# EasyEDA Pro project ProPrj_MOSSE_2026-03-25.epro, schematic Schematic2
Board Name: Board2; Create Date: 2026-03-15; Page Name: P1; Project Name: MOSSE; Schematic Name: Schematic2; Update Date: 2026-03-15; Company: EasyEDA.com; Page Size: A4; Version: V1.0
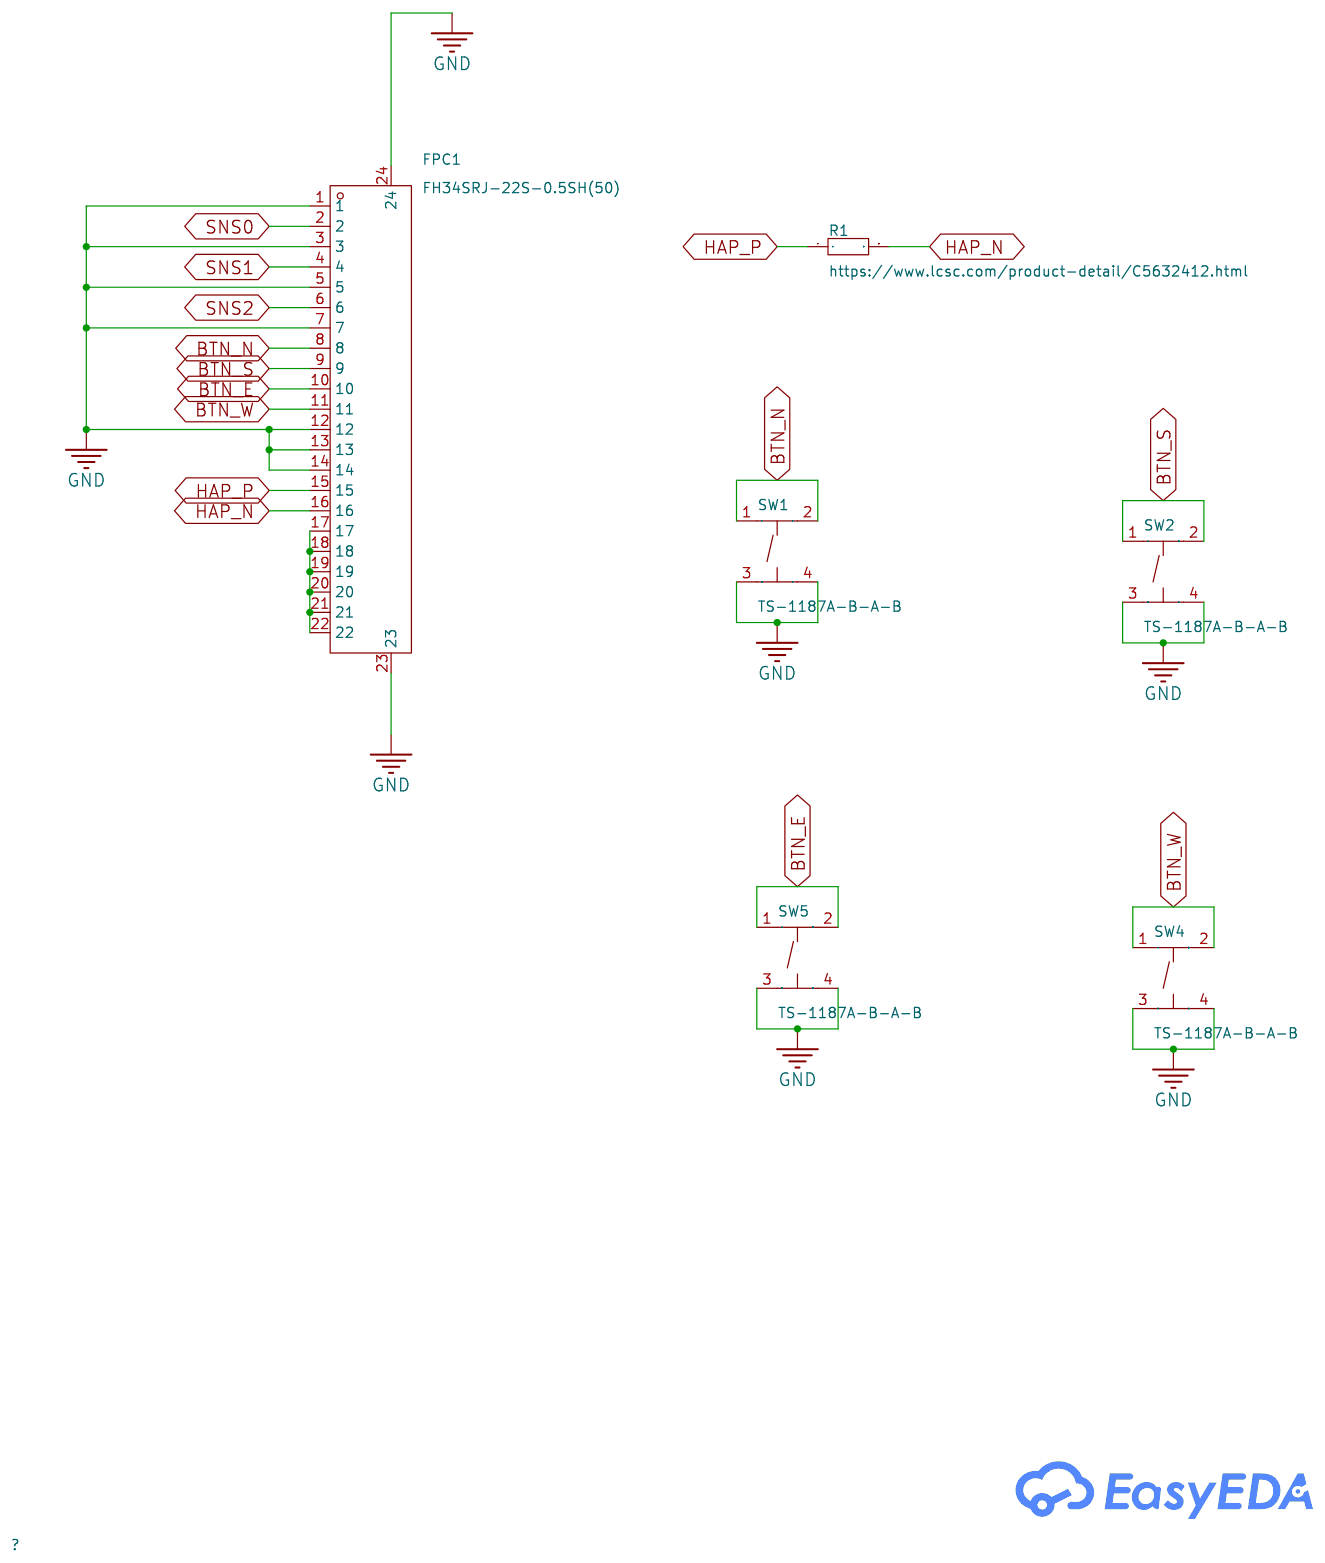
[diagram p5: schematic sheet]

## Parts
FPC1  FH34SRJ-22S-0.5SH(50)  [FFC-SMD_22P-P0.50_HRS_FH34SRJ-22S-0.5SH]
R1  https://www.lcsc.com/product-detail/C5632412.html  [R2010]
SW1  TS-1187A-B-A-B  [SW-SMD_4P-L5.1-W5.1-P3.70-LS6.5-TL_H1.5]
SW2  TS-1187A-B-A-B  [SW-SMD_4P-L5.1-W5.1-P3.70-LS6.5-TL_H1.5]
SW4  TS-1187A-B-A-B  [SW-SMD_4P-L5.1-W5.1-P3.70-LS6.5-TL_H1.5]
SW5  TS-1187A-B-A-B  [SW-SMD_4P-L5.1-W5.1-P3.70-LS6.5-TL_H1.5]

## Library data of the parts
FPC1 = FH34SRJ-22S-0.5SH(50): Locking Feature:- Contact Type:Bottom Contact Number of Contacts:22P Pitch:0.5mm Mounting Type:Horizontal attachment FFC, FCB Thickness:0.3mm FFC, FCB Thickness:0.3mm Height Above Board:1mm Contact Material:Phosphor Bronze Contact Plating:Gold Operating T; LCSC Part Name: 间距:0.5mm P数:22P 下接; Supplier Part: C2889325; Manufacturer: HRS(广濑); Supplier Footprint: SMD,P=0.5mm,卧贴; JLCPCB Part Class: Extended Part; Datasheet: https://atta.szlcsc.com/upload/public/pdf/source/20210903/F493DA4F8E43C57734DEE75CD24FFA7F.pdf; Supplier: LCSC; Contact Type: Bottom Contact; Number of Contacts: 22P; Pitch: 0.5mm; Mounting Type: Horizontal attachment; FFC, FCB Thickness: 0.3mm; Height Above Board: 1mm; Contact Material: Phosphor Bronze; Contact Plating: Gold; Operating Temperature Range: -55℃~+105℃
R1 = Res_2010: Supplier Footprint: 2010
SW1 SW2 SW4 SW5 = TS-1187A-B-A-B: Circuit:SPST Actuator Style:Round Button Operating Force:1.6N Mounting Type:Surface Mount,Vertical Length:5.1mm Width:5.1mm Switch Height:1.5mm with Bracket:Without Bracket Contact Current:50mA Voltage Rating:12V Actuator/Cap Color:Gold With Lamp:No Life:; LCSC Part Name: 5.1*5.1*1.5mm 立贴 轻触开关; Supplier Part: C318884; Manufacturer: XKB Connection(中国星坤); Supplier Footprint: SMD; JLCPCB Part Class: Basic Part; Datasheet: https://item.szlcsc.com/datasheet/TS-1187A-B-A-B/299976.html; Supplier: LCSC; Circuit: SPST; Actuator Style: Round Button; Operating Force: 1.6N; Mounting Type: Surface Mount,Vertical; Length: 5.1mm; Width: 5.1mm; Switch Height: 1.5mm; with Bracket: Without Bracket; Contact Current: 50mA; Voltage Rating: 12V; Actuator/Cap Color: Gold; With Lamp: No; Life: 100,000 Cycles; Operating Temperature: -30℃~+85℃

## Nets
GND: FPC1.1 FPC1.3 FPC1.5 FPC1.7 FPC1.12 FPC1.13 FPC1.14 FPC1.23 FPC1.24 SW1.3(C) SW1.4(D) SW2.3(C) SW2.4(D) SW4.3(C) SW4.4(D) SW5.3(C) SW5.4(D)
BTN_E: FPC1.10 SW5.1(A) SW5.2(B)
BTN_N: FPC1.8 SW1.1(A) SW1.2(B)
BTN_S: FPC1.9 SW2.1(A) SW2.2(B)
BTN_W: FPC1.11 SW4.1(A) SW4.2(B)
HAP_N: FPC1.16 R1.2
HAP_P: FPC1.15 R1.1
SNS0: FPC1.2
SNS1: FPC1.4
SNS2: FPC1.6
$1N315: FPC1.17 FPC1.18 FPC1.19 FPC1.20 FPC1.21 FPC1.22
